# EAGLE design driver_board (EAGLE 6.1)

## Sheet 1 of 5: STM1_Sonary
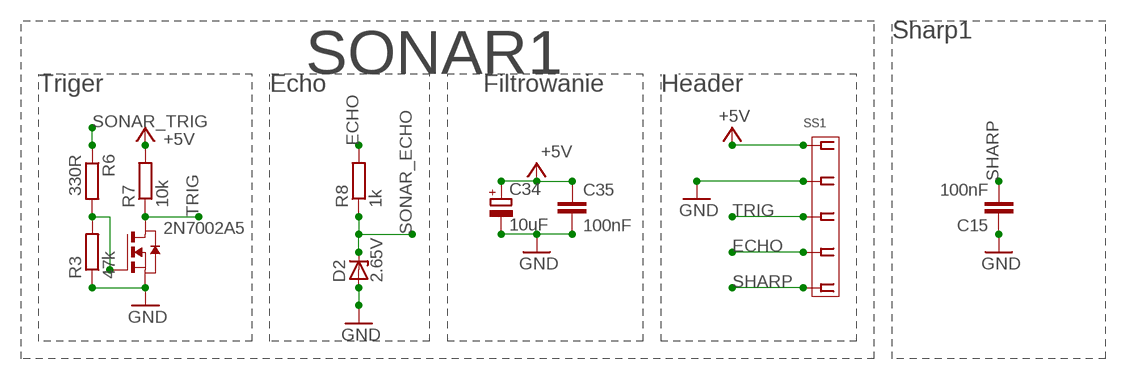
[diagram p0: schematic, sheet 1]

### Parts
2N7002A5  NMOSSOT23  [SOT-23]
C15  100nF  C-EUC0805  [C0805]
C34  10uF  CPOL-EUSMCA  [SMC_A]
C35  100nF  C-EUC0805  [C0805]
D2  2.65V  ZENER-DIODESOT23  [SOT23]
R3  47k  R-EU_R0805  [R0805]
R6  330R  R-EU_R0805  [R0805]
R7  10k  R-EU_R0805  [R0805]
R8  1k  R-EU_R0805  [R0805]
SS1  MOLEX-5268-05  [MOLEX-5268-05]

### Nets
+5V: C34.+ C35.1 R7.2 SS1.P$1 ; also sheet 3,5
ECHO: R8.2 SS1.P$4
GND: 2N7002A5.2(S) C15.1 C34.- C35.2 D2.1(A) R3.1 SS1.P$2 ; also sheet 2,3,4,5
N$2: 2N7002A5.3(G) R3.2 R6.2
SHARP: C15.2 SS1.P$5 ; also sheet 2
SONAR_ECHO: D2.3(C) R8.1 ; also sheet 2
SONAR_TRIG: R6.1 ; also sheet 2
TRIG: 2N7002A5.1(D) R7.1 SS1.P$3

### Notes on the sheet
- Sharp1
- SONAR1
- Triger | Echo | Filtrowanie | Header

## Sheet 2 of 5: STM2_Mikrokontroler
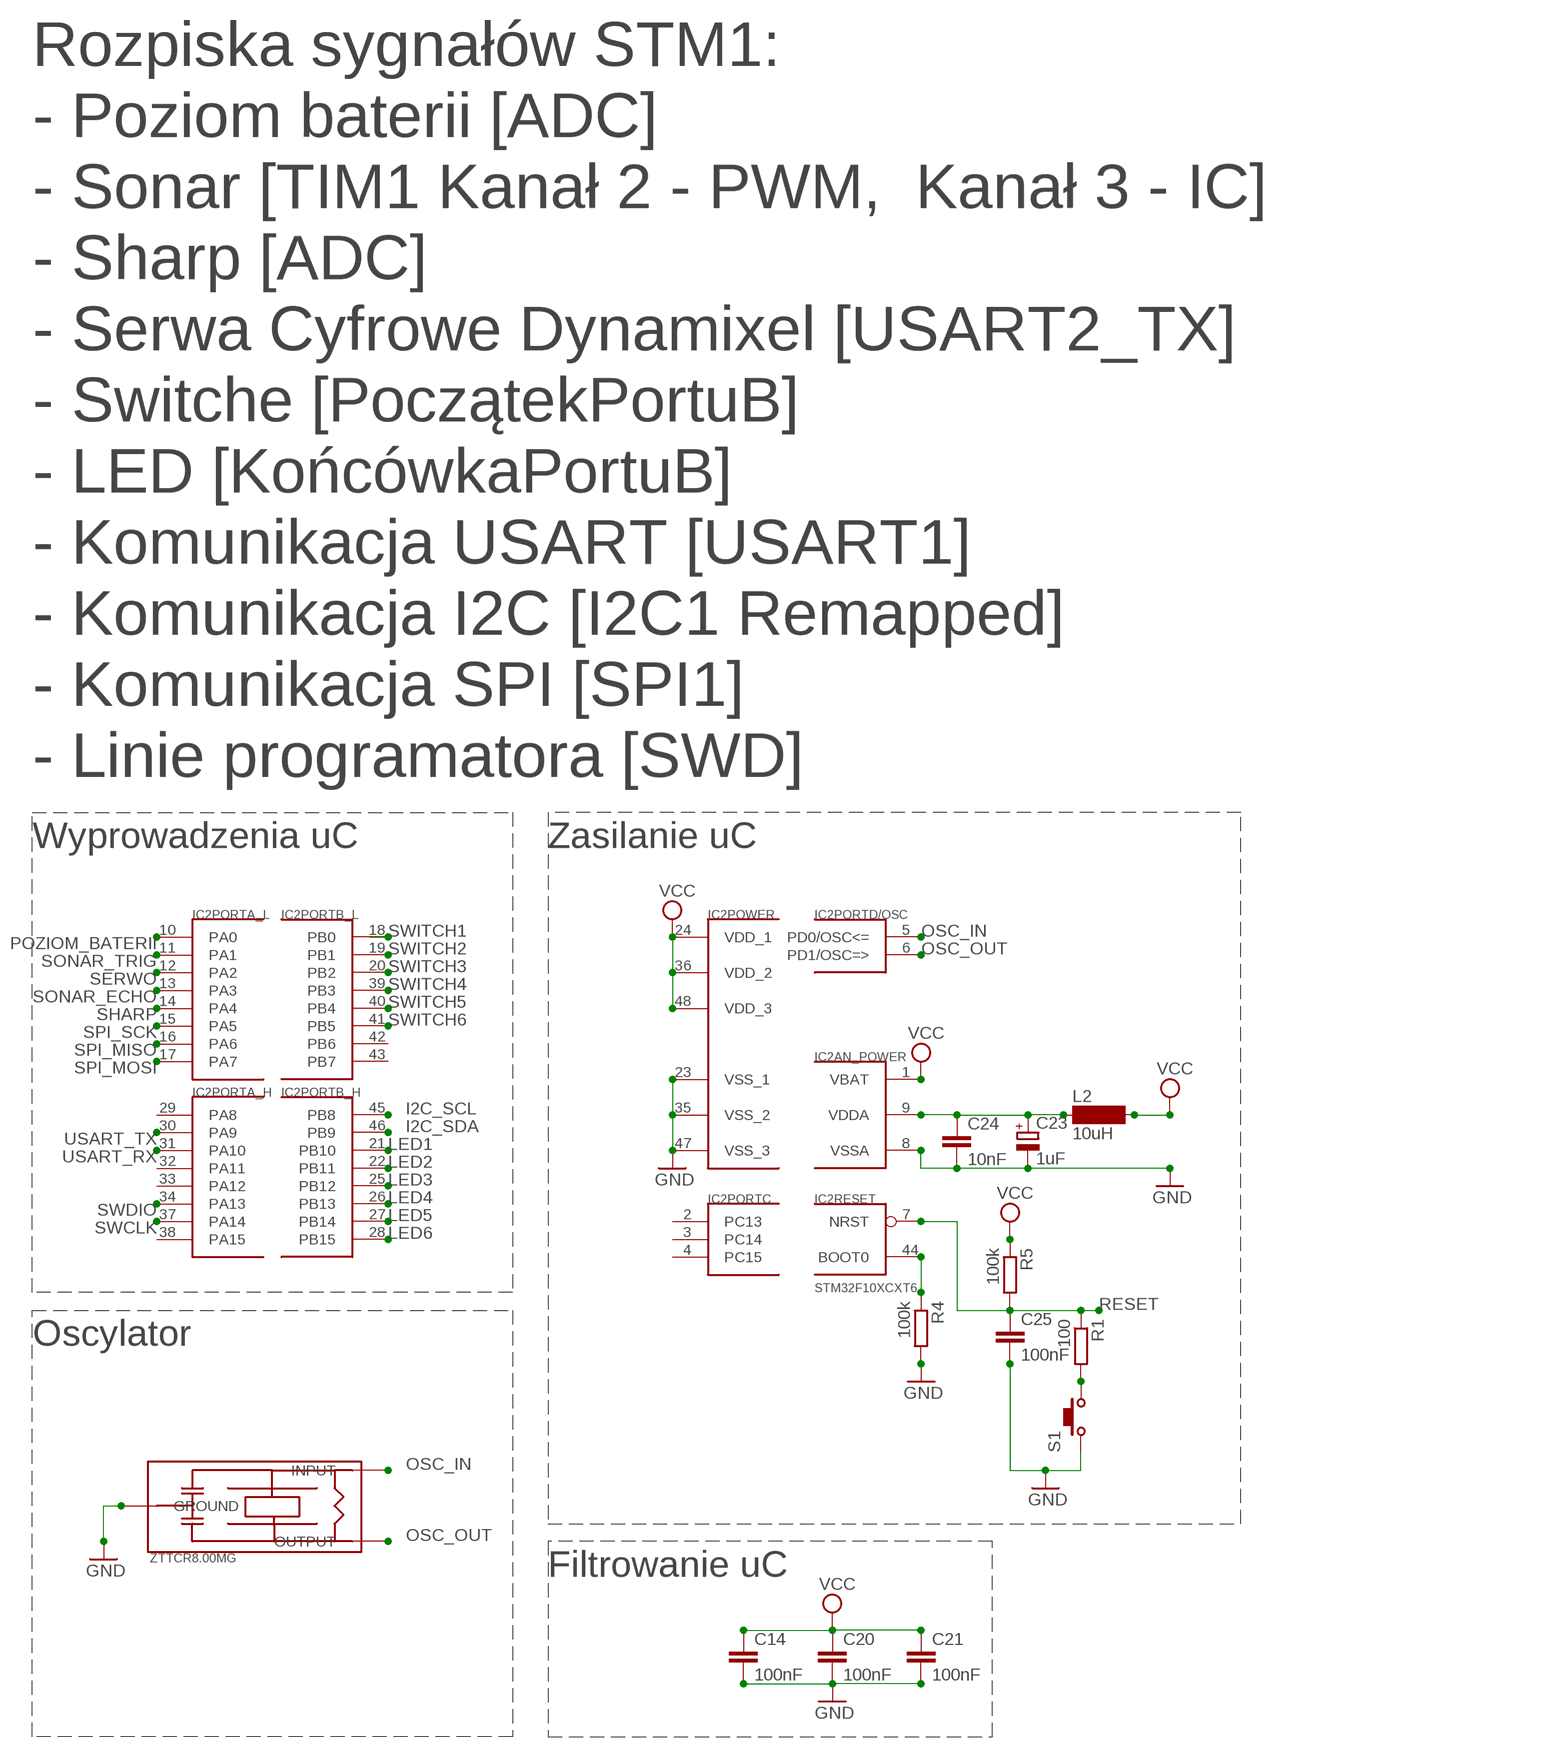
[diagram p1: schematic, sheet 2]

### Parts
C14  100nF  C-EUC0805  [C0805]
C20  100nF  C-EUC0805  [C0805]
C21  100nF  C-EUC0805  [C0805]
C23  1uF  CPOL-EUSMCA  [SMC_A]
C24  10nF  C-EUC0805  [C0805]
C25  100nF  C-EUC0805  [C0805]
IC2  STM32F10XCXT6  [TQFP48]
L2  10uH  SM-1206  [SM-1206]
R1  100  R-EU_R0805  [R0805]
R4  100k  R-EU_R0805  [R0805]
R5  100k  R-EU_R0805  [R0805]
S1  TACT-6XX-SMD  [TACT-6XX-SMD]
U$8  ZTTCR8.00MG  [ZTTCR8.00MG]

### Nets
GND: C14.2 C20.2 C21.2 C23.- C24.2 C25.2 IC2.8(AN_POWER:VSSA) IC2.23(POWER:VSS_1) IC2.35(POWER:VSS_2) IC2.47(POWER:VSS_3) R4.2 S1.P$1 U$8.GROUND ; also sheet 1,3,4,5
I2C_SCL: IC2.45(PORTB_H:PB8) ; also sheet 4
I2C_SDA: IC2.46(PORTB_H:PB9) ; also sheet 4
LED1: IC2.21(PORTB_H:PB10) ; also sheet 3
LED2: IC2.22(PORTB_H:PB11) ; also sheet 3
LED3: IC2.25(PORTB_H:PB12) ; also sheet 3
LED4: IC2.26(PORTB_H:PB13) ; also sheet 3
LED5: IC2.27(PORTB_H:PB14) ; also sheet 3
LED6: IC2.28(PORTB_H:PB15) ; also sheet 3
N$3: R1.2 S1.P$3
N$6: C23.+ C24.1 IC2.9(AN_POWER:VDDA) L2.1
N$7: IC2.44(RESET:BOOT0) R4.1
OSC_IN: IC2.5(PORTD/OSC:PD0/OSC<=) U$8.INPUT
OSC_OUT: IC2.6(PORTD/OSC:PD1/OSC=>) U$8.OUTPUT
POZIOM_BATERII: IC2.10(PORTA_L:PA0) ; also sheet 5
RESET: C25.1 IC2.7(RESET:NRST) R1.1 R5.2
SERWO: IC2.12(PORTA_L:PA2) ; also sheet 3
SHARP: IC2.14(PORTA_L:PA4) ; also sheet 1
SONAR_ECHO: IC2.13(PORTA_L:PA3) ; also sheet 1
SONAR_TRIG: IC2.11(PORTA_L:PA1) ; also sheet 1
SPI_MISO: IC2.16(PORTA_L:PA6) ; also sheet 3,4
SPI_MOSI: IC2.17(PORTA_L:PA7) ; also sheet 3,4
SPI_SCK: IC2.15(PORTA_L:PA5) ; also sheet 3,4
SWCLK: IC2.37(PORTA_H:PA14) ; also sheet 5
SWDIO: IC2.34(PORTA_H:PA13) ; also sheet 5
SWITCH1: IC2.18(PORTB_L:PB0) ; also sheet 3
SWITCH2: IC2.19(PORTB_L:PB1) ; also sheet 3
SWITCH3: IC2.20(PORTB_L:PB2) ; also sheet 3
SWITCH4: IC2.39(PORTB_L:PB3) ; also sheet 3
SWITCH5: IC2.40(PORTB_L:PB4) ; also sheet 3
SWITCH6: IC2.41(PORTB_L:PB5) ; also sheet 3
USART_RX: IC2.31(PORTA_H:PA10) ; also sheet 4
USART_TX: IC2.30(PORTA_H:PA9) ; also sheet 4
VCC: C14.1 C20.1 C21.1 IC2.1(AN_POWER:VBAT) IC2.24(POWER:VDD_1) IC2.36(POWER:VDD_2) IC2.48(POWER:VDD_3) L2.2 R5.1 ; also sheet 3,4,5
Unconnected: IC2.2(PORTC:PC13) IC2.3(PORTC:PC14) IC2.4(PORTC:PC15) IC2.29(PORTA_H:PA8) IC2.32(PORTA_H:PA11) IC2.33(PORTA_H:PA12) IC2.38(PORTA_H:PA15) IC2.42(PORTB_L:PB6) IC2.43(PORTB_L:PB7) S1.P$2 S1.P$4

### Notes on the sheet
- Rozpiska sygnałów STM1:
- - Poziom baterii [ADC]
- - Sonar [TIM1 Kanał 2 - PWM,  Kanał 3 - IC]
- - Sharp [ADC]
- - Serwa Cyfrowe Dynamixel [USART2_TX]
- - Switche [PoczątekPortuB]
- - LED [KońcówkaPortuB]
- - Komunikacja USART [USART1]
- - Komunikacja I2C [I2C1 Remapped]
- - Komunikacja SPI [SPI1]
- - Linie programatora [SWD]
- Wyprowadzenia uC | Zasilanie uC
- Oscylator
- Filtrowanie uC

## Sheet 3 of 5: STM2_Switch+LED+Złącza
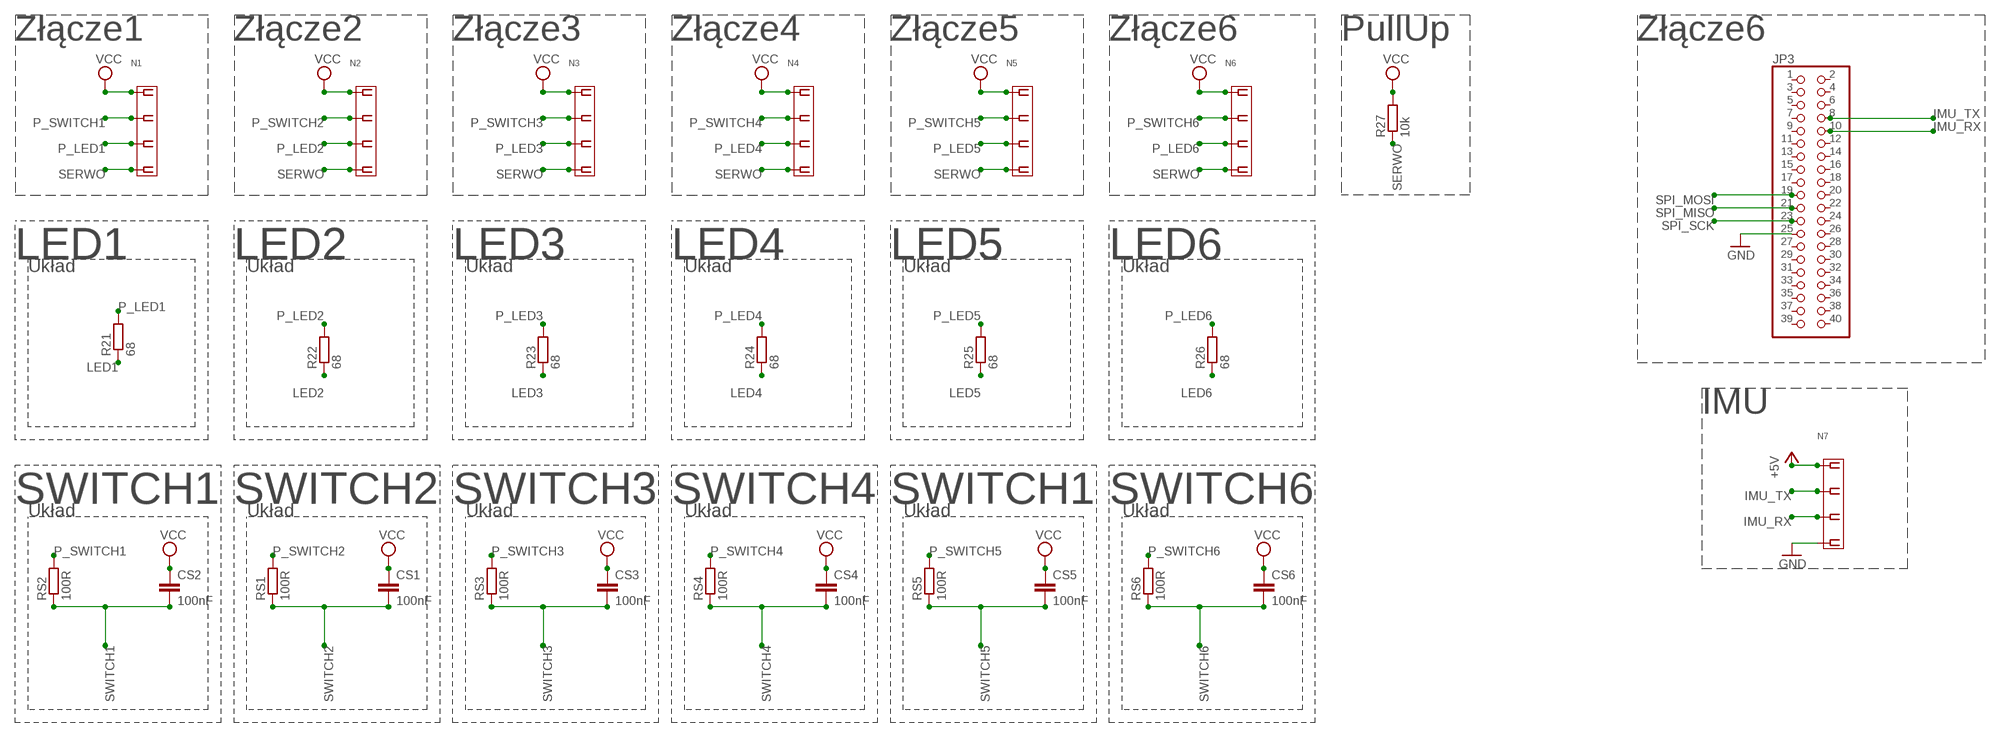
[diagram p2: schematic, sheet 3]

### Parts
CS1  100nF  C-EUC0805  [C0805]
CS2  100nF  C-EUC0805  [C0805]
CS3  100nF  C-EUC0805  [C0805]
CS4  100nF  C-EUC0805  [C0805]
CS5  100nF  C-EUC0805  [C0805]
CS6  100nF  C-EUC0805  [C0805]
JP3  PINHD-2X20  [2X20]
N1  MOLEX-5268-04  [MOLEX-5268-04]
N2  MOLEX-5268-04  [MOLEX-5268-04]
N3  MOLEX-5268-04  [MOLEX-5268-04]
N4  MOLEX-5268-04  [MOLEX-5268-04]
N5  MOLEX-5268-04  [MOLEX-5268-04]
N6  MOLEX-5268-04  [MOLEX-5268-04]
N7  MOLEX-5268-04  [MOLEX-5268-04]
R21  68  R-EU_R0805  [R0805]
R22  68  R-EU_R0805  [R0805]
R23  68  R-EU_R0805  [R0805]
R24  68  R-EU_R0805  [R0805]
R25  68  R-EU_R0805  [R0805]
R26  68  R-EU_R0805  [R0805]
R27  10k  R-EU_R0805  [R0805]
RS1  100R  R-EU_R0805  [R0805]
RS2  100R  R-EU_R0805  [R0805]
RS3  100R  R-EU_R0805  [R0805]
RS4  100R  R-EU_R0805  [R0805]
RS5  100R  R-EU_R0805  [R0805]
RS6  100R  R-EU_R0805  [R0805]

### Nets
+5V: N7.P$1 ; also sheet 1,5
GND: JP3.25 N7.P$4 ; also sheet 1,2,4,5
IMU_RX: JP3.10 N7.P$3
IMU_TX: JP3.8 N7.P$2
LED1: R21.1 ; also sheet 2
LED2: R22.1 ; also sheet 2
LED3: R23.1 ; also sheet 2
LED4: R24.1 ; also sheet 2
LED5: R25.1 ; also sheet 2
LED6: R26.1 ; also sheet 2
P_LED1: N1.P$3 R21.2
P_LED2: N2.P$3 R22.2
P_LED3: N3.P$3 R23.2
P_LED4: N4.P$3 R24.2
P_LED5: N5.P$3 R25.2
P_LED6: N6.P$3 R26.2
P_SWITCH1: N1.P$2 RS2.2
P_SWITCH2: N2.P$2 RS1.2
P_SWITCH3: N3.P$2 RS3.2
P_SWITCH4: N4.P$2 RS4.2
P_SWITCH5: N5.P$2 RS5.2
P_SWITCH6: N6.P$2 RS6.2
SERWO: N1.P$4 N2.P$4 N3.P$4 N4.P$4 N5.P$4 N6.P$4 R27.1 ; also sheet 2
SPI_MISO: JP3.21 ; also sheet 2,4
SPI_MOSI: JP3.19 ; also sheet 2,4
SPI_SCK: JP3.23 ; also sheet 2,4
SWITCH1: CS2.2 RS2.1 ; also sheet 2
SWITCH2: CS1.2 RS1.1 ; also sheet 2
SWITCH3: CS3.2 RS3.1 ; also sheet 2
SWITCH4: CS4.2 RS4.1 ; also sheet 2
SWITCH5: CS5.2 RS5.1 ; also sheet 2
SWITCH6: CS6.2 RS6.1 ; also sheet 2
VCC: CS1.1 CS2.1 CS3.1 CS4.1 CS5.1 CS6.1 N1.P$1 N2.P$1 N3.P$1 N4.P$1 N5.P$1 N6.P$1 R27.2 ; also sheet 2,4,5
Unconnected: JP3.1 JP3.2 JP3.3 JP3.4 JP3.5 JP3.6 JP3.7 JP3.9 JP3.11 JP3.12 JP3.13 JP3.14 JP3.15 JP3.16 JP3.17 JP3.18 JP3.20 JP3.22 JP3.24 JP3.26 JP3.27 JP3.28 JP3.29 JP3.30 JP3.31 JP3.32 JP3.33 JP3.34 JP3.35 JP3.36 JP3.37 JP3.38 JP3.39 JP3.40

### Notes on the sheet
- Złącze1 | Złącze2 | Złącze3 | Złącze4 | Złącze5 | Złącze6 | PullUp | Złącze6
- LED1 | LED2 | LED3 | LED4 | LED5 | LED6
- Układ | Układ | Układ | Układ | Układ | Układ
- IMU
- SWITCH1 | SWITCH2 | SWITCH3 | SWITCH4 | SWITCH1 | SWITCH6
- Układ | Układ | Układ | Układ | Układ | Układ

## Sheet 4 of 5: Interfejsy
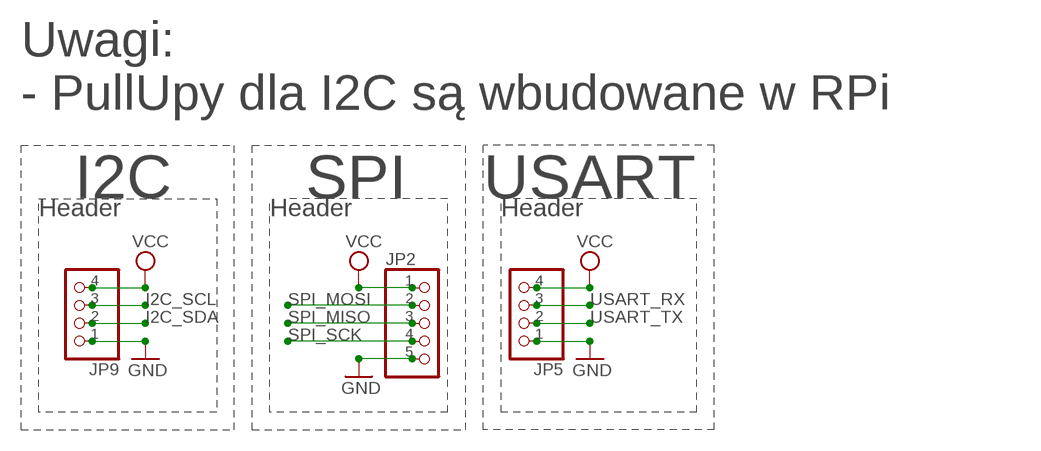
[diagram p3: schematic, sheet 4]

### Parts
JP2  PINHD-1X5  [1X05]
JP5  PINHD-1X4  [1X04]
JP9  PINHD-1X4  [1X04]

### Nets
GND: JP2.5 JP5.1 JP9.1 ; also sheet 1,2,3,5
I2C_SCL: JP9.3 ; also sheet 2
I2C_SDA: JP9.2 ; also sheet 2
SPI_MISO: JP2.3 ; also sheet 2,3
SPI_MOSI: JP2.2 ; also sheet 2,3
SPI_SCK: JP2.4 ; also sheet 2,3
USART_RX: JP5.3 ; also sheet 2
USART_TX: JP5.2 ; also sheet 2
VCC: JP2.1 JP5.4 JP9.4 ; also sheet 2,3,5

### Notes on the sheet
- Uwagi:
- - PullUpy dla I2C są wbudowane w RPi
- I2C | SPI | USART
- Header | Header | Header

## Sheet 5 of 5: Zasilanie układu
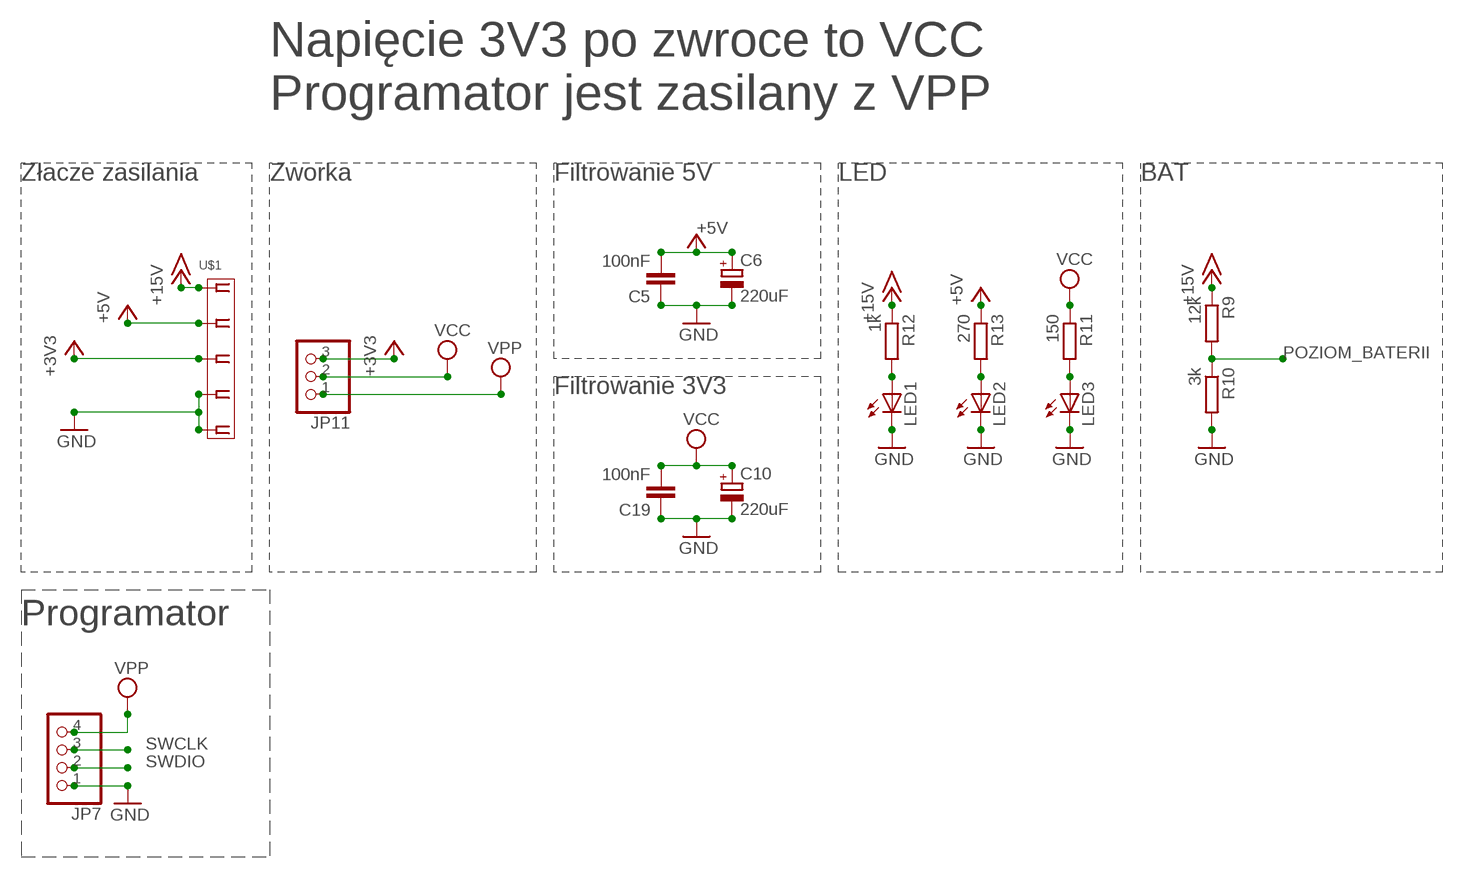
[diagram p4: schematic, sheet 5]

### Parts
C5  100nF  C-EUC0805  [C0805]
C6  220uF  CPOL-EUSMCA  [SMC_A]
C10  220uF  CPOL-EUSMCA  [SMC_A]
C19  100nF  C-EUC0805  [C0805]
JP7  PINHD-1X4  [1X04]
JP11  PINHD-1X3  [1X03]
LED1  LEDCHIPLED_0805  [CHIPLED_0805]
LED2  LEDCHIPLED_0805  [CHIPLED_0805]
LED3  LEDCHIPLED_0805  [CHIPLED_0805]
R9  12k  R-EU_R0805  [R0805]
R10  3k  R-EU_R0805  [R0805]
R11  150  R-EU_R0805  [R0805]
R12  1k  R-EU_R0805  [R0805]
R13  270  R-EU_R0805  [R0805]
U$1  MOLEX-5268-05  [MOLEX-5268-05]

### Nets
+3V3: JP11.3 U$1.P$3
+5V: C5.2 C6.+ R13.1 U$1.P$2 ; also sheet 1,3
+15V: R9.1 R12.1 U$1.P$1
GND: C5.1 C6.- C10.- C19.1 JP7.1 LED1.C LED2.C LED3.C R10.2 U$1.P$4 U$1.P$5 ; also sheet 1,2,3,4
N$16: LED2.A R13.2
N$17: LED3.A R11.2
N$18: LED1.A R12.2
POZIOM_BATERII: R9.2 R10.1 ; also sheet 2
SWCLK: JP7.3 ; also sheet 2
SWDIO: JP7.2 ; also sheet 2
VCC: C10.+ C19.2 JP11.2 R11.1 ; also sheet 2,3,4
VPP: JP7.4 JP11.1

### Notes on the sheet
- Napięcie 3V3 po zwroce to VCC
- Programator jest zasilany z VPP
- Złacze zasilania | Zworka | Filtrowanie 5V | LED | BAT
- Filtrowanie 3V3
- Programator

## Library data of the parts
2N7002A5 = zetex:NMOSSOT23: MOS FET; OC_FARNELL: unknown; OC_NEWARK: unknown
C5 C14 C15 C19-C21 C24 C25 C35 CS1-CS6 = rcl:C-EU: CAPACITOR, European symbol
C6 C10 C23 C34 = rcl:CPOL-EU: POLARIZED CAPACITOR, European symbol
D2 = diode:ZENER-DIODE: Z-Diode
IC2 = stm32:STM32F10XCXT6: ST STM32F101/103 48pin LQFP
JP2 = pinhead:PINHD-1X5: PIN HEADER
JP3 = pinhead:PINHD-2X20: PIN HEADER
JP5 JP7 JP9 = pinhead:PINHD-1X4: PIN HEADER
JP11 = pinhead:PINHD-1X3: PIN HEADER
L2 = inductor-neosid:SM-1206: INDUCTOR SMD chip inductor; OC_FARNELL: unknown; OC_NEWARK: unknown
LED1-LED3 = led:LED: LED OSRAM: - CHIPLED LG R971, LG N971, LY N971, LG Q971, LY Q971, LO R971, LY R971 LH N974, LH R974 LS Q976, LO Q976, LY Q976 LO Q996 - Hyper CHIPLED LW Q18S LB Q993, LB Q99A, LB R99A - SideLED LS A670, LO A670, LY A670, LG A670, LP A670 LB A673, LV A673, LT A673, LW A673 LH A674 LY A675 LS A676, LA A676, LO A676, LY A676, LW A676 LS A679, LY A679, LG A679 - Hyper Micro SIDELED® LS Y876, LA Y876, LO Y876, LY Y876 LT Y87S - SmartLED LW L88C, LW L88S LB L89C, LB L89S, LG L890 LS L89K, LO L89K, LY L89K LS L896, LA L896, LO L896, LY L896 - TOPLED LS T670, LO T670, LY T670, LG T670, LP T670 LSG T670, LSP T670, LSY T670, LOP T670, LYG T670 LG T671, LOG T671, LSG T671 LB T673, LV T673, LT T673, LW T673 LH T674 LS T676, LA T676, LO T676, LY T676, LB T676, LH T676, LSB T676, LW T676 LB T67C, LV T67C, LT T67C, LS T67K, LO T67K, LY T67K, LW E67C LS E67B, LA E67B, LO E67B, LY E67B, LB E67C, LV E67C, LT E67C LW T67C LS T679, LY T679, LG T679 LS T770, LO T770, LY T770, LG T770, LP T770 LB T773, LV T773, LT T773, LW T773 LH T774 LS E675, LA E675, LY E675, LS T675 LS T776, LA T776, LO T776, LY T776, LB T776 LHGB T686 LT T68C, LB T68C - Hyper Mini TOPLED® LB M676 - Mini TOPLED Santana® LG M470 LS M47K, LO M47K, LY M47K Source: http://www.osram.convergy.de LUXEON: - LUMILED® LXK2-PW12-R00, LXK2-PW12-S00, LXK2-PW14-U00, LXK2-PW14-V00 LXK2-PM12-R00, LXK2-PM12-S00, LXK2-PM14-U00 LXK2-PE12-Q00, LXK2-PE12-R00, LXK2-PE12-S00, LXK2-PE14-T00, LXK2-PE14-U00 LXK2-PB12-K00, LXK2-PB12-L00, LXK2-PB12-M00, LXK2-PB14-N00, LXK2-PB14-P00, LXK2-PB14-Q00 LXK2-PR12-L00, LXK2-PR12-M00, LXK2-PR14-Q00, LXK2-PR14-R00 LXK2-PD12-Q00, LXK2-PD12-R00, LXK2-PD12-S00 LXK2-PH12-R00, LXK2-PH12-S00 LXK2-PL12-P00, LXK2-PL12-Q00, LXK2-PL12-R00 Source: www.luxeon.com KINGBRIGHT: KA-3528ASYC Source: www.kingbright.com
N1-N7 = MOLEX-5268:MOLEX-5268-04
R1 R3-R13 R21-R27 RS1-RS6 = rcl:R-EU_: RESISTOR, European symbol
S1 = Robodudes:TACT-6XX-SMD
SS1 U$1 = MOLEX-5268:MOLEX-5268-05
U$8 = rezonator_smd:ZTTCR8.00MG

## Board
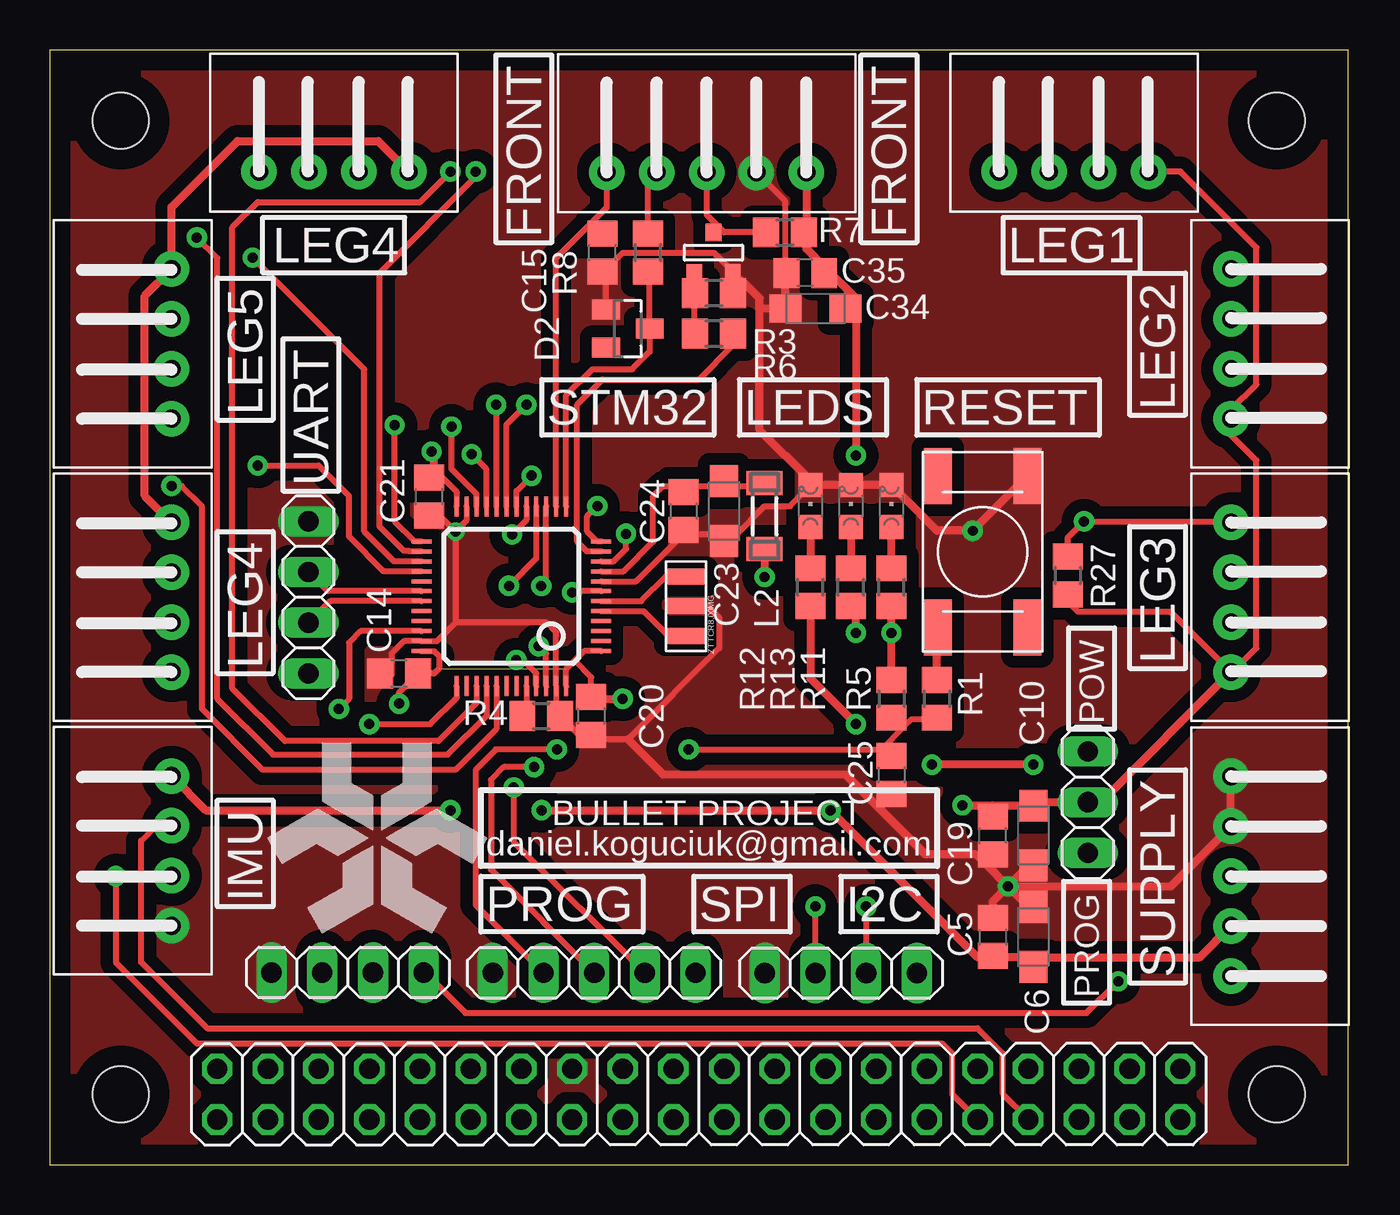
[diagram p5: board, top side]
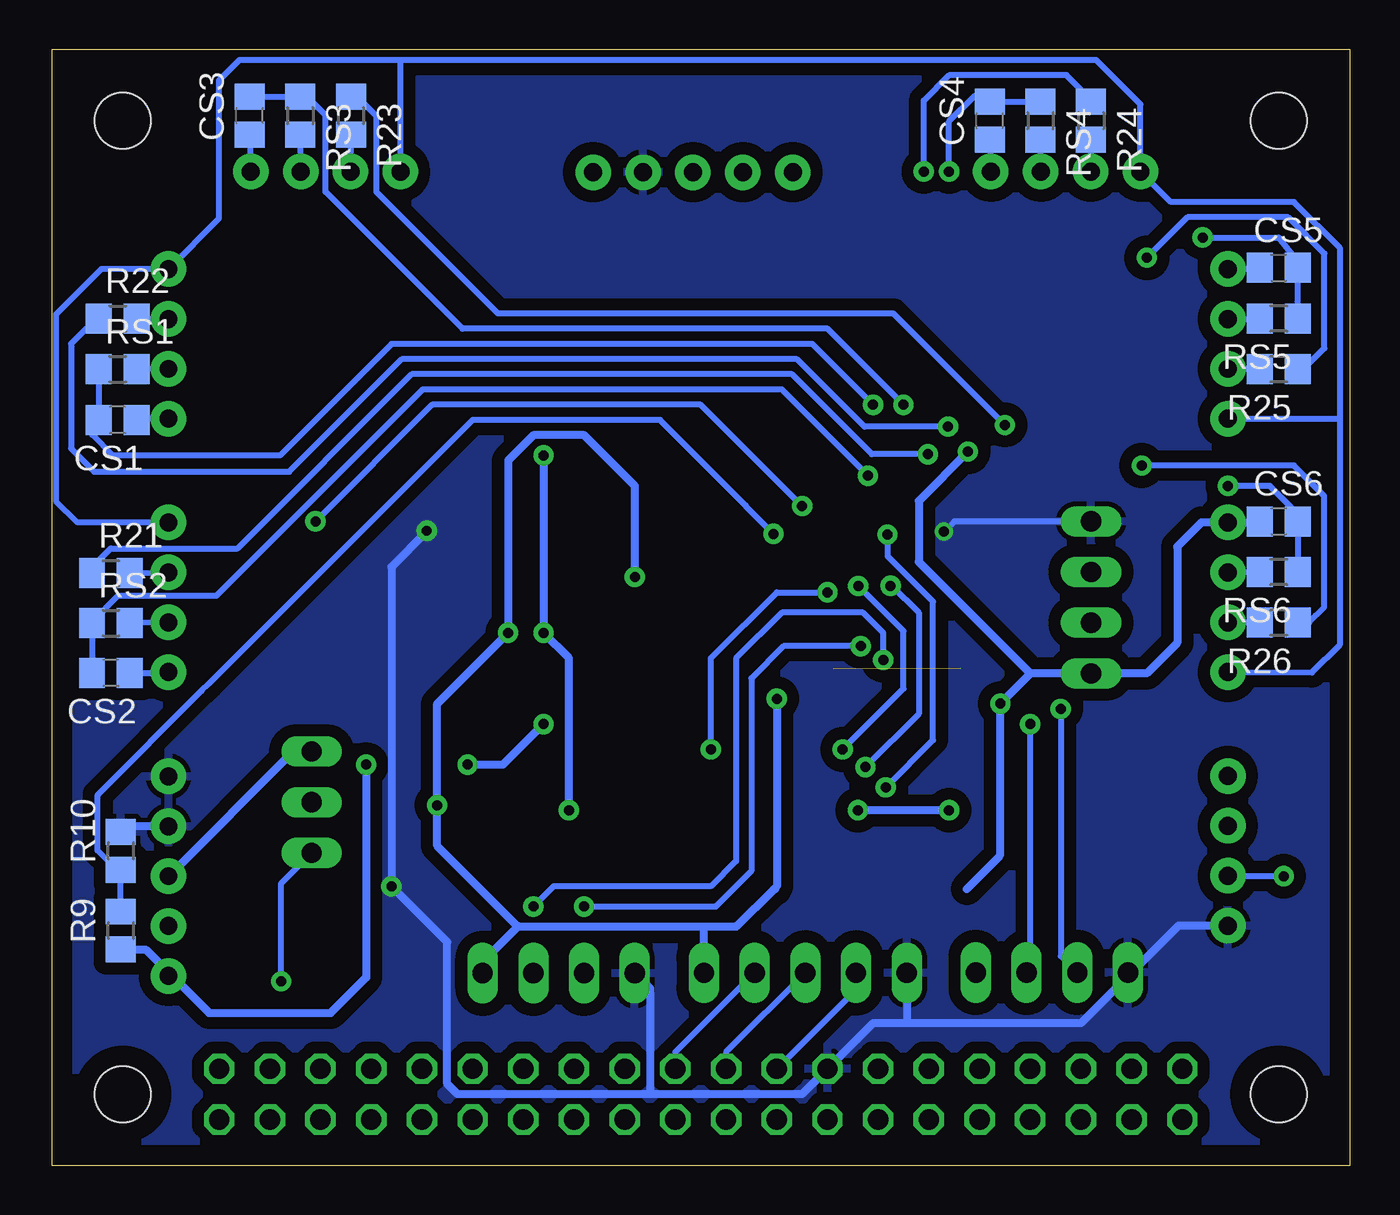
[diagram p6: board, bottom side, seen from below]

Size 65.02 x 55.88 mm. Coordinates in mm from the lower left corner, seen from the top.
Outline: 65.02,0 0,0 0,55.88 65.02,55.88 65.02,0
Copper layers (1*16): Top 0.035mm / dielectric 1.5mm / Bottom 0.035mm
Design rules: minimum track width 10mil, minimum drill 24mil, track to track 10mil, track to pad 10mil, pad to pad 10mil, via to via 10mil, smd to smd 0mil, copper to edge 40mil, drill to drill 8mil, minimum pad ring 10mil, minimum via ring 8mil, stop-mask expansion 4mil, vias tented up to drill 0mil, thermal gap 10mil
Holes 2.8 mm at 3.56,52.32 61.47,52.32 61.47,3.56 3.56,3.56

### Footprints (pad centres in the part's own frame; a part is rotated, then mirrored left to right if it is on the bottom)
SOT-23 = smd 0.787 x 0.889: 1 0.025,-1.016; 2 -0.94,1.016; 3 0.991,1.016
C0805 = smd 1.3 x 1.5: 1 -0.95,0; 2 0.95,0
SMC_A = smd 1.6 x 1.4: + -1.5,0; - 1.5,0
SOT23 = smd 1 x 1.4: 1 -0.95,-1.1; 2 0.95,-1.1; 3 0,1.1
TQFP48 = smd 0.2 x 1: 1 -2.75,-4.5; 2 -2.25,-4.5; 3 -1.75,-4.5; 4 -1.25,-4.5; 5 -0.75,-4.5; 6 -0.25,-4.5; 7 0.25,-4.5; 8 0.75,-4.5; 9 1.25,-4.5; 10 1.75,-4.5; 11 2.25,-4.5; 12 2.75,-4.5; 25 2.75,4.5; 26 2.25,4.5; 27 1.75,4.5; 28 1.25,4.5; 29 0.75,4.5; 30 0.25,4.5; 31 -0.25,4.5; 32 -0.75,4.5; 33 -1.25,4.5; 34 -1.75,4.5; 35 -2.25,4.5; 36 -2.75,4.5 | smd 1 x 0.2: 13 4.5,-2.75; 14 4.5,-2.25; 15 4.5,-1.75; 16 4.5,-1.25; 17 4.5,-0.75; 18 4.5,-0.25; 19 4.5,0.25; 20 4.5,0.75; 21 4.5,1.25; 22 4.5,1.75; 23 4.5,2.25; 24 4.5,2.75; 37 -4.5,2.75; 38 -4.5,2.25; 39 -4.5,1.75; 40 -4.5,1.25; 41 -4.5,0.75; 42 -4.5,0.25; 43 -4.5,-0.25; 44 -4.5,-0.75; 45 -4.5,-1.25; 46 -4.5,-1.75; 47 -4.5,-2.25; 48 -4.5,-2.75
1X05 = drill 1.016 long: 1 -5.08,0; 2 -2.54,0; 3 0,0; 4 2.54,0; 5 5.08,0
2X20 = drill 1.016 octagon: 1 -24.13,-1.27; 2 -24.13,1.27; 3 -21.59,-1.27; 4 -21.59,1.27; 5 -19.05,-1.27; 6 -19.05,1.27; 7 -16.51,-1.27; 8 -16.51,1.27; 9 -13.97,-1.27; 10 -13.97,1.27; 11 -11.43,-1.27; 12 -11.43,1.27; 13 -8.89,-1.27; 14 -8.89,1.27; 15 -6.35,-1.27; 16 -6.35,1.27; 17 -3.81,-1.27; 18 -3.81,1.27; 19 -1.27,-1.27; 20 -1.27,1.27; 21 1.27,-1.27; 22 1.27,1.27; 23 3.81,-1.27; 24 3.81,1.27; 25 6.35,-1.27; 26 6.35,1.27; 27 8.89,-1.27; 28 8.89,1.27; 29 11.43,-1.27; 30 11.43,1.27; 31 13.97,-1.27; 32 13.97,1.27; 33 16.51,-1.27; 34 16.51,1.27; 35 19.05,-1.27; 36 19.05,1.27; 37 21.59,-1.27; 38 21.59,1.27; 39 24.13,-1.27; 40 24.13,1.27
1X04 = drill 1.016 long: 1 -3.81,0; 2 -1.27,0; 3 1.27,0; 4 3.81,0
1X03 = drill 1.016 long: 1 -2.54,0; 2 0,0; 3 2.54,0
SM-1206 = smd 1.2 x 1.8: 1 -1.65,0; 2 1.65,0
CHIPLED_0805 = smd 1.2 x 1.2: A 0,-1.05; C 0,1.05
MOLEX-5268-04 = drill 0.9 pad 1.778: P$1 0,3.75; P$2 0,1.25; P$3 0,-1.25; P$4 0,-3.75
R0805 = smd 1.3 x 1.5: 1 -0.95,0; 2 0.95,0
TACT-6XX-SMD = smd 2.8 x 1.4: P$1 -3.8,2.25; P$2 -3.8,-2.25; P$3 3.8,-2.25; P$4 3.8,2.25
MOLEX-5268-05 = drill 0.9 pad 1.778: P$1 0,5; P$2 0,2.5; P$3 0,0; P$4 0,-2.5; P$5 0,-5
ZTTCR8.00MG = smd 0.8 x 2: GROUND 0,0; INPUT -1.5,0; OUTPUT 1.5,0

### Placement (x,y rotation side)
2N7002A5  33.27,45.72 180 top
C5  47.24,11.43 270 top
C6  49.28,11.43 90 top
C10  49.28,16.51 270 top
C14  17.5,24.63 180 top
C15  27.69,45.72 90 top
C19  47.24,16.51 90 top
C20  27.12,22.5 270 top
C21  19,33.5 270 top
C23  33.78,32.77 270 top
C24  31.75,32.77 270 top
C25  42.16,19.56 270 top
C34  38.35,42.93 180 top
C35  37.85,44.7 180 top
CS1  61.72,37.34 180 bottom
CS2  62.06,24.66 180 bottom
CS3  55.12,52.58 90 bottom
CS4  18.03,52.32 90 bottom
CS5  3.56,44.96 0 bottom
CS6  3.56,32.26 0 bottom
D2  28.96,41.91 270 top
IC2  23.12,28.5 90 top
JP2  27.27,9.63 180 top
JP3  32.51,3.56 180 top
JP5  12.95,28.45 270 top
JP7  14.91,9.65 0 top
JP9  39.63,9.61 0 top
JP11  52.01,18.18 90 top
L2  35.81,32.52 270 top
LED1  38.1,33.02 0 top
LED2  40.13,33.02 0 top
LED3  42.16,33.02 0 top
N1  59.18,28.45 180 top
N2  59.18,41.15 180 top
N3  51.31,49.78 270 top
N4  14.22,49.78 270 top
N5  6.1,41.15 0 top
N6  6.1,28.45 0 top
N7  6.1,15.75 0 top
R1  44.45,23.37 90 top
R3  33.27,43.69 180 top
R4  24.62,22.5 0 top
R5  42.16,23.37 270 top
R6  33.27,41.66 180 top
R7  36.83,46.74 0 top
R8  29.97,45.72 90 top
R9  61.56,11.75 90 bottom
R10  61.56,15.75 90 bottom
R11  42.16,28.96 90 top
R12  38.1,28.96 90 top
R13  40.13,28.96 90 top
R21  62.06,29.66 0 bottom
R22  61.72,42.42 0 bottom
R23  50.04,52.58 270 bottom
R24  12.95,52.32 270 bottom
R25  3.56,39.88 180 bottom
R26  3.56,27.18 180 bottom
R27  51,29.55 270 top
RS1  61.72,39.88 0 bottom
RS2  62.06,27.16 0 bottom
RS3  52.58,52.58 270 bottom
RS4  15.49,52.32 270 bottom
RS5  3.56,42.42 180 bottom
RS6  3.56,29.72 180 bottom
S1  46.74,30.73 270 top
SS1  32.9,49.75 270 top
U$1  59.18,14.48 180 top
U$8  31.87,28 90 top

### Tracks (layer width: path | path; a pad name or v marks a point on that pad's centre or on a via)
+3V3
  Bottom 0.406: JP11.3 52.94,20.72 U$1.P$3
+5V  (via drill 0.5 pad 1.02)
  Top 0.305: R7.2 37.9,46.74 | C35.1 38.8,45.02 | C34.+ 40.39,42.93 | C6.+ 49.3,9.91 49.3,10.14 49.02,10.41 | C5.2 47.43,10.48 47.5,10.41
  Top 0.406: SS1.P$1 37.9,46.74 37.9,45.92 38.8,45.02 40.39,43.43 40.39,42.93 v40.39,35.56 | v24.64,17.78 v39.12,17.78 46.48,10.41 47.5,10.41 49.02,10.41 57.62,10.41 U$1.P$2 | v40.39,26.67 40.39,27.69 40.13,27.94 R13.1 | N7.P$1 7.81,17.78 v20.07,17.78
  Bottom 0.406: v40.39,35.56 v40.39,26.67 39.12,25.4 v39.12,17.78 | v20.07,17.78 v24.64,17.78
+15V  (via drill 0.5 pad 1.02)
  Top 0.406: R12.1 38.1,24.38 v40.39,22.1 | v49.28,20.07 v44.2,20.07
  Bottom 0.406: R9.1 60.33,10.8 59.05,9.53 | 59.05,9.53 57.15,7.62 51.05,7.62 49.28,9.4 v49.28,20.07 | U$1.P$1 59.1,9.48 59.05,9.53 | v44.2,20.07 42.42,20.07 v40.39,22.1
ECHO
  Top 0.305: R8.2 29.97,49.32 SS1.P$4
GND  (via drill 0.5, 0.5 pad 1.02)
  Top 0.305: C14.2 17.12,24.55 17.12,25.63 17.75,26.25 IC2.35 19.4,26.25 20.32,27.18 | C20.2 26.52,21.55 R4.2 25.37,22.7 IC2.47 25.37,26.7 24.89,27.18 20.32,27.18 | C21.2 19,32.38 19.69,32.38 v20.32,31.75 | 27.37,21.38 27.2,21.55 C20.2 | 27.34,21.55 C20.2 | U$8.GROUND 32.96,28 33.53,27.43 33.53,25.91 28.96,21.34 27.34,21.34 C20.2 | SS1.P$2 36.82,48.33 36.82,44.69 36.77,44.64 36.83,44.58 36.9,44.64 C35.2 | D2.1 27.86,44.87 | 27.86,44.87 28.7,45.72 33.27,45.72 34.8,44.2 34.73,44.2 R3.1 2N7002A5.2 | IC2.23 20.87,32.3 v20.32,31.75 | v20.32,31.75 20.32,27.18 | 27.86,44.87 27.77,44.87 27.69,44.96 C15.1 | 48.73,12.38 C6.- | 36.83,42.93 C34.- | IC2.8 29.37,29.25 31.75,31.63 | C24.2 31.75,31.63 | 31.75,31.63 34.04,31.63 | C23.- 33.78,31.38 34.04,31.63 | 34.04,31.63 34.43,31.63 35.81,33.02 37.08,33.02 38.1,34.04 LED1.C
  Top 0.406: C10.- 49.05,15.01 v48.01,13.97 | C6.- 49.05,12.93 v48.01,13.97 | C5.1 47.24,13.21 v48.01,13.97 | 35.56,42.93 35.56,36.83 38.1,34.29 LED1.C LED2.C LED3.C 44.45,31.78 v46.24,31.78 S1.P$1 | 35.56,42.93 35.56,43.43 34.8,44.2 | C34.- 36.85,44.66 C35.2 | 36.83,42.93 35.56,42.93 | 41.53,17.91 43.88,15.56 46.42,15.56 46.86,15.11 | C25.2 42.16,18.54 41.53,17.91 | v48.01,13.97 46.86,15.11 | C19.1 46.86,15.18 46.86,15.11 | 41.53,17.91 39.88,19.56 30.73,19.56 28.96,21.34 | v48.01,13.97 56.17,13.97 U$1.P$4 U$1.P$5
  Bottom 0.305: 61.28,16.98 R10.2 | JP5.1 19.81,32.26 v20.32,31.75
  Bottom 0.406: U$1.P$4 61.28,16.98 | N7.P$4 8.58,12 10.92,9.65 | 10.92,9.65 13.46,7.11 22.1,7.11 | JP7.1 10.92,9.65 | 22.1,7.11 23.88,7.11 JP3.25 27.43,3.56 35.05,3.56 | JP2.5 22.19,7.21 22.1,7.11 | 35.05,3.56 44.7,3.56 45.21,4.06 45.21,11.18 v48.01,13.97 48.01,29.97 46.24,31.74 v46.24,31.78 | JP9.1 35.05,8.85 35.05,3.56
  pour Top (isolate 0.61, no thermals): 0,55.88 65.02,55.88 65.02,0 0,0
  pour Bottom (isolate 0.61): 0,55.88 65.02,55.88 65.02,0 0,0
I2C_SCL  (via drill 0.5 pad 1.02)
  Top 0.305: IC2.45 24.37,24.65 23.72,25.31 v23.37,25.31 | v40.89,12.95 JP9.3
  Bottom 0.305: v23.37,25.31 23.37,26.67 24.38,27.69 28.45,27.69 30.73,25.4 30.73,15.24 32,13.97 39.88,13.97 v40.89,12.95
I2C_SDA  (via drill 0.5 pad 1.02)
  Top 0.305: IC2.46 24.87,25.62 v24.5,26 | JP9.2 38.36,9.65 v38.35,12.95
  Bottom 0.305: v24.5,26 28.36,26 29.97,24.38 29.97,14.73 31.75,12.95 v38.35,12.95
IMU_RX  (via drill 0.5 pad 1.02)
  Top 0.305: JP3.10 45.21,3.56 45.21,5.59 44.7,6.1 7.37,6.1 3.3,10.16 v3.3,14.48
  Bottom 0.305: N7.P$3 3.32,14.5 v3.3,14.48
IMU_TX
  Top 0.305: JP3.8 47.75,3.56 47.75,5.59 46.48,6.86 7.87,6.86 4.57,10.16 4.57,16.26 5.33,17.02 5.35,17 N7.P$2
LED1  (via drill 0.5 pad 1.02)
  Top 0.305: IC2.21 21.87,34.88 v21.12,35.62
  Bottom 0.305: R21.1 63.01,29.96 62.06,30.91 55.71,30.91 46.99,39.62 27.94,39.62 23.94,35.62 v21.12,35.62
LED2  (via drill 0.5 pad 1.02)
  Top 0.305: IC2.22 21.37,33.63 20.12,34.88 v20.12,37
  Bottom 0.305: R22.1 63.01,42.21 64.06,41.16 64.06,35.91 62.91,34.75 53.13,34.75 47.5,40.39 27.69,40.39 24.3,37 v20.12,37
LED3  (via drill 0.5 pad 1.02)
  Top 0.305: IC2.25 18.25,31.25 18.25,31.28 17.27,32.26 v17.27,37.08
  Bottom 0.305: R23.1 49.76,53.57 48.77,52.58 48.77,48.77 42.67,42.67 22.86,42.67 v17.27,37.08
LED4  (via drill 0.5 pad 1.02)
  Top 0.305: IC2.26 18,30.75 18,30.77 17.74,30.77 16.51,32 16.51,44.7 21.34,49.53 v21.34,49.78
  Bottom 0.305: R24.1 13.13,53.57 14.18,54.62 14.2,54.61 20.07,54.61 21.34,53.34 v21.34,49.78
LED5  (via drill 0.5 pad 1.02)
  Top 0.305: IC2.27 17.24,30.25 15.75,31.75 15.75,39.88 v10.16,45.47
  Bottom 0.305: R25.1 2.31,39.88 1.26,40.93 1.26,45.68 3.08,47.5 8.13,47.5 v10.16,45.47
LED6  (via drill 0.5 pad 1.02)
  Top 0.305: IC2.28 16.73,29.75 14.99,31.5 14.99,33.53 13.46,35.05 v10.41,35.05
  Bottom 0.305: R26.1 2.31,27.2 2.01,27.2 1.27,27.94 1.27,33.53 2.79,35.05 v10.41,35.05
N$2
  Top 0.305: 2N7002A5.3 32.28,43.69 | 32.28,43.69 32.28,41.66 R6.2 | R3.2 32.28,43.69
N$3
  Top 0.406: R1.2 44.45,26.9 S1.P$3
N$6
  Top 0.305: IC2.9 28.74,29.75 30.23,31.24 30.23,33.53 30.73,34.04 31.75,34.04 | C24.1 31.75,34.04 | 31.75,34.04 33.78,34.04 | 33.78,34.04 35.81,34.04 L2.1 | C23.+ 33.78,34.04
N$7
  Top 0.305: IC2.44 23.87,22.7 R4.1
N$16
  Top 0.406: LED2.A R13.2
N$17
  Top 0.406: R11.2 LED3.A
N$18
  Top 0.406: LED1.A R12.2
OSC_IN
  Top 0.305: U$8.INPUT 31,26.5 29.75,27.75 IC2.5
OSC_OUT
  Top 0.305: U$8.OUTPUT 30.87,29.5 29.62,28.25 IC2.6
P_LED1
  Bottom 0.305: R21.2 N1.P$3
P_LED2
  Bottom 0.305: N2.P$3 R22.2
P_LED3
  Bottom 0.305: N3.P$3 R23.2
P_LED4
  Bottom 0.305: R24.2 N4.P$3
P_LED5
  Bottom 0.305: N5.P$3 4.27,39.9 R25.2
P_LED6
  Bottom 0.305: R26.2 N6.P$3
P_SWITCH1
  Bottom 0.305: N1.P$2 RS2.2
P_SWITCH2
  Bottom 0.305: N2.P$2 RS1.2
P_SWITCH3
  Bottom 0.305: RS3.2 N3.P$2
P_SWITCH4
  Bottom 0.305: RS4.2 N4.P$2
P_SWITCH5
  Bottom 0.305: N5.P$2 4.53,42.4 RS5.2
P_SWITCH6
  Bottom 0.305: RS6.2 N6.P$2
POZIOM_BATERII  (via drill 0.5 pad 1.02)
  Top 0.305: IC2.10 28.25,30.25 28.87,30.88 v28.87,31.63
  Bottom 0.305: R9.2 R10.1 61.79,14.8 62.74,15.75 62.74,18.54 57.53,23.75 57.15,24.13 43.94,37.34 34.54,37.34 30.26,33.06 30.26,33.02 v28.87,31.63
RESET  (via drill 0.5 pad 1.02)
  Top 0.305: 42.35,20.51 C25.1 41.98,20.51 41.66,20.83 | 42.16,22.35 R5.2 42.35,22.42 42.8,21.97 | v32,20.83 41.66,20.83 | 41.66,20.83 42.8,21.97 | 42.8,21.97 43.18,22.35 44.38,22.35 R1.1 | IC2.7 26.21,28.75 v26.16,28.7
  Bottom 0.305: v32,20.83 32,25.4 28.7,28.7 v26.16,28.7
SERWO  (via drill 0.5 pad 1.02)
  Top 0.305: IC2.12 27.42,31.25 26.92,31.75 26.92,32.51 v27.43,33.02 | N1.P$4 59.12,32.26 v51.82,32.26 51,31.44 R27.1
  Bottom 0.305: N6.P$4 1.88,24.68 0.51,26.06 0.51,37.34 | v27.43,33.02 32.51,38.1 45.97,38.1 v51.82,32.26 | 0.51,37.34 0.51,45.97 2.79,48.26 8.95,48.26 N4.P$4 10.47,53.15 12.7,55.37 47.5,55.37 | N5.P$4 0.56,37.4 0.51,37.34 | 47.5,55.37 55.63,55.37 56.64,54.36 56.64,47.44 N2.P$4 62.54,44.9 64.82,42.62 64.82,33.29 63.73,32.2 N1.P$4 | N3.P$4 47.56,55.31 47.5,55.37
SHARP
  Top 0.305: SS1.P$5 27.9,47.97 27.05,47.12 | 27.05,47.12 25.37,45.44 IC2.14 | C15.2 27.5,46.67 27.05,47.12
SONAR_ECHO
  Top 0.305: R8.1 30.06,44.69 D2.3 30.06,40.76 29.17,39.88 27.18,39.88 25.87,38.57 IC2.13
SONAR_TRIG
  Top 0.305: IC2.11 26.9,30.75 26.42,31.24 26.42,38.1 27.69,39.37 32.51,39.37 34.22,41.08 R6.1
SPI_MISO  (via drill 0.5 pad 1.02)
  Top 0.305: IC2.16 24.37,30.4 v23,29.03 | JP2.3 22.1,14.81 22.1,19.3 22.73,19.94 v24.26,19.94
  Bottom 0.305: 27.22,9.63 JP2.3 31.24,5.66 JP3.21 | v23,29.03 22.93,29.03 21.59,27.69 21.59,22.61 v24.26,19.94
SPI_MOSI  (via drill 0.5 pad 1.02)
  Top 0.305: JP2.2 23.24,16.2 v23.24,18.92 | IC2.17 23.87,32.31 v23.15,31.59
  Bottom 0.305: JP3.19 33.78,5.66 JP2.2 | v23.15,31.59 23.15,30.52 20.87,28.23 20.87,21.3 v23.24,18.92
SPI_SCK  (via drill 0.5 pad 1.02)
  Top 0.305: v24.62,29.02 24.87,29.27 IC2.15 | JP2.4 21.34,13.03 21.34,19.81 22.35,20.83 v25.4,20.83
  Bottom 0.305: 24.72,9.64 JP2.4 24.72,8.81 JP3.23 | v24.62,29.02 22.35,26.75 22.35,23.88 v25.4,20.83
SWCLK  (via drill 0.5 pad 1.02)
  Top 0.305: IC2.37 20.37,23.42 19.05,22.1 v16,22.1
  Bottom 0.305: v16,22.1 16,9.83 JP7.3
SWDIO  (via drill 0.5 pad 1.02)
  Top 0.305: IC2.34 15.58,26.75 14.99,26.16 14.99,23.37 v14.48,22.86
  Bottom 0.305: v14.48,22.86 14.48,10.48 JP7.2
SWITCH1  (via drill 0.5 pad 1.02)
  Top 0.305: IC2.18 23.37,33.78 v24.13,34.54
  Bottom 0.305: CS2.2 RS2.1 63.01,27.21 61.69,28.53 56.78,28.53 46.45,38.86 28.45,38.86 v24.13,34.54
SWITCH2  (via drill 0.5 pad 1.02)
  Top 0.305: IC2.19 22.87,37.09 v23.88,38.1
  Bottom 0.305: RS1.1 CS1.2 63.01,36.6 61.98,35.56 53.59,35.56 48.01,41.15 26.92,41.15 v23.88,38.1
SWITCH3  (via drill 0.5 pad 1.02)
  Top 0.305: IC2.20 22.37,38.08 v22.35,38.1
  Bottom 0.305: CS3.2 RS3.1 52.27,53.57 51.31,52.61 51.31,48.77 44.45,41.91 26.16,41.91 v22.35,38.1
SWITCH4  (via drill 0.5 pad 1.02)
  Top 0.305: v20.07,49.78 18.54,48.26 10.41,48.26 9.14,46.99 9.14,23.88 11.78,21.24 19.46,21.24 21.37,23.15 IC2.39
  Bottom 0.305: RS4.1 CS4.2 18.8,53.57 20.07,52.3 v20.07,49.78
SWITCH5  (via drill 0.5 pad 1.02)
  Top 0.305: IC2.40 21.87,22.51 19.94,20.57 11.18,20.57 8.38,23.37 8.38,45.47 v7.37,46.48
  Bottom 0.305: RS5.1 CS5.2 2.31,45.1 2.43,45.1 3.56,46.48 | v7.37,46.48 3.56,46.48 | 3.56,46.48
SWITCH6  (via drill 0.5 pad 1.02)
  Top 0.305: v6.1,34.04 6.6,34.04 7.62,33.02 7.62,22.86 10.67,19.81 20.32,19.81 22.37,21.86 IC2.41
  Bottom 0.305: 2.43,29.8 RS6.1 CS6.2 2.43,32.48 3.99,34.04 v6.1,34.04
TRIG
  Top 0.305: SS1.P$3 32.9,47.62 33.66,46.86 | R7.1 33.78,46.74 33.66,46.86 | 2N7002A5.1 33.27,46.74 33.66,46.86
USART_RX
  Top 0.305: IC2.31 14.03,28.25 JP5.3
USART_TX
  Top 0.305: IC2.30 13.92,28.75 JP5.2
VCC  (via drill 0.5 pad 1.02)  (1 unrouted)
  Top 0.305: 18.45,24.58 C14.1 | C21.1 19.67,34.45 | 19.67,34.45 20.37,33.75 IC2.24 | 19.67,34.45 19.25,34.88 | v17.5,23.12 17.5,23.68 C14.1 | C14.1 19.25,24.63 19.5,24.88 19.5,25.5 19.25,25.75 IC2.36 | C14.1 18.37,24.63 | 27.55,23.7 27.55,23.33 | C19.2 47.24,18.01 | 27.55,23.33 27.42,23.45 C20.1 27.12,24.44 26.29,25.27 | N3.P$1 56.64,49.78 60.45,45.97 60.45,39.12 59.18,37.85 N2.P$1 59.18,36.58 60.45,35.31 60.45,25.91 59.24,24.7 N1.P$1 56.16,27.72 51.53,27.72 51.05,28.19 R27.2 | IC2.48 25.87,24.86 26.29,25.27 | 26.29,25.27 26.77,25.75 IC2.1 | 27.55,23.33 27.59,23.37 | L2.2
  Top 0.406: 19.25,34.88 19.25,35.63 v19.12,35.75 | N6.P$1 4.76,33.53 4.76,43.56 N5.P$1 6.1,48.01 9.4,51.31 16.45,51.31 N4.P$1 | 27.59,23.37 v28.7,23.37 | v45.72,18.03 47.24,18.03 | 47.24,18.03 49.25,18.03 C10.+ 49.28,18.03 49.42,18.18 JP11.2 52.67,18.18 N1.P$1 | 47.24,18.01 47.24,18.03 | R11.1 v42.16,26.67 R5.1 | L2.2 v35.81,29.46
  Bottom 0.305: 4.35,32.2 CS6.1 | CS5.1 4.3,44.9 N5.P$1 | N4.P$1 17.97,51.59 CS4.1 | N2.P$1 61,37.4 CS1.1 | CS3.1 55.07,49.79 N3.P$1 | 59.24,24.64 N1.P$1 59.18,24.64 59.2,24.66 CS2.1 | 17.53,23.37 v17.51,23.11 v17.5,23.12 | 28.78,13.82 28.78,13.89 28.7,13.97
  Bottom 0.406: 4.35,32.2 N6.P$1 7.43,32.2 8.64,30.99 8.64,26.16 10.16,24.64 JP5.4 15.98,24.64 | 15.98,24.64 v17.5,23.12 | 32.26,11.94 30.73,11.94 28.85,13.82 28.78,13.82 | 32.26,11.94 41.62,11.94 41.66,11.97 | JP2.1 32.35,11.84 32.26,11.94 | JP9.4 43.44,10.19 41.66,11.97 | v28.7,23.37 28.7,13.97 | 41.66,11.97 41.69,11.97 45.72,16 v45.72,18.03 45.72,23.11 v42.16,26.67 42.16,35.31 40.89,36.58 38.35,36.58 35.81,34.04 v35.81,29.46 | 17.53,23.37 17.53,15.49 19.19,13.83 | v19.12,35.75 v19.12,35.74 21.59,33.27 21.59,30.23 16,24.64 15.98,24.64
VPP  (via drill 0.5 pad 1.02)
  Top 0.305: JP7.4 18.8,9.65 20.83,7.62 51.94,7.62 v53.53,9.21
  Bottom 0.305: v53.53,9.21 53.53,14.12 JP11.1

### Text on the board
tNames: LEG4 | FRONT | FRONT | LEG1 | LEG5 | LEG2 | STM32 | LEDS | RESET | UART | LEG4 | LEG3 | POW | BULLET PROJECT | daniel.koguciuk@gmail.com | IMU | PROG | SPI | I2C | SUPPLY | PROG